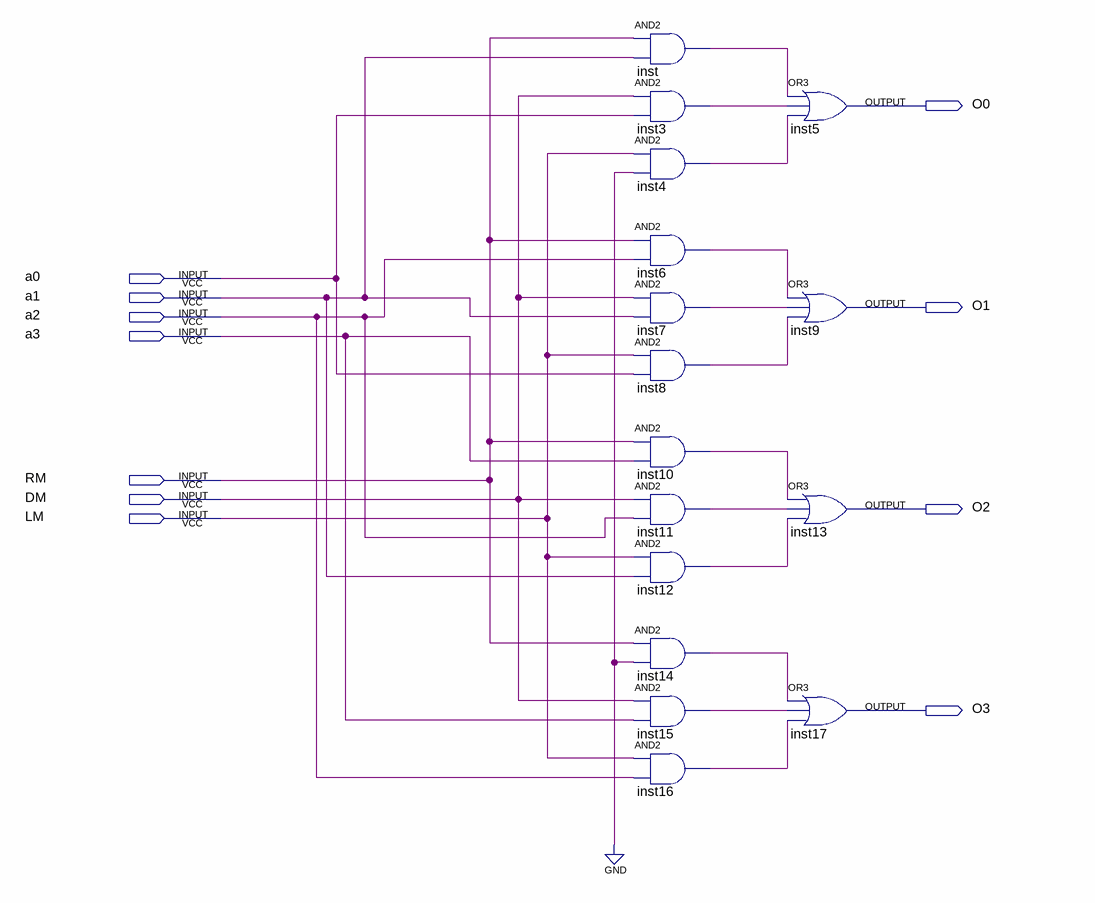
[diagram p0: schematic sheet]
// Quartus schematic SHIFTER.bdf as structural Verilog: 16 symbols, 11 pins
module SHIFTER (
  input  a0,
  input  a1,
  input  a2,
  input  a3,
  input  RM,
  input  DM,
  input  LM,
  output O0,
  output O1,
  output O2,
  output O3
);

  wire inst3_out, inst4_out, inst6_out, inst7_out, inst8_out, inst10_out, inst11_out, inst12_out, inst14_out,
       inst15_out, inst16_out, inst_out;

  and inst (inst_out, RM, a1);
  and inst3 (inst3_out, DM, a0);
  and inst4 (inst4_out, LM, 1'b0);
  and inst6 (inst6_out, RM, a2);
  and inst7 (inst7_out, DM, a1);
  and inst8 (inst8_out, LM, a0);
  and inst10 (inst10_out, RM, a3);
  and inst11 (inst11_out, DM, a2);
  and inst12 (inst12_out, LM, a1);
  and inst14 (inst14_out, RM, 1'b0);
  and inst15 (inst15_out, DM, a3);
  and inst16 (inst16_out, LM, a2);
  or inst5 (O0, inst_out, inst3_out, inst4_out);
  or inst9 (O1, inst6_out, inst7_out, inst8_out);
  or inst13 (O2, inst10_out, inst11_out, inst12_out);
  or inst17 (O3, inst14_out, inst15_out, inst16_out);
endmodule
